# Altium schematic sheet 00_POWER.SchDoc
size A; SheetNumber: 1; SheetTotal: 5
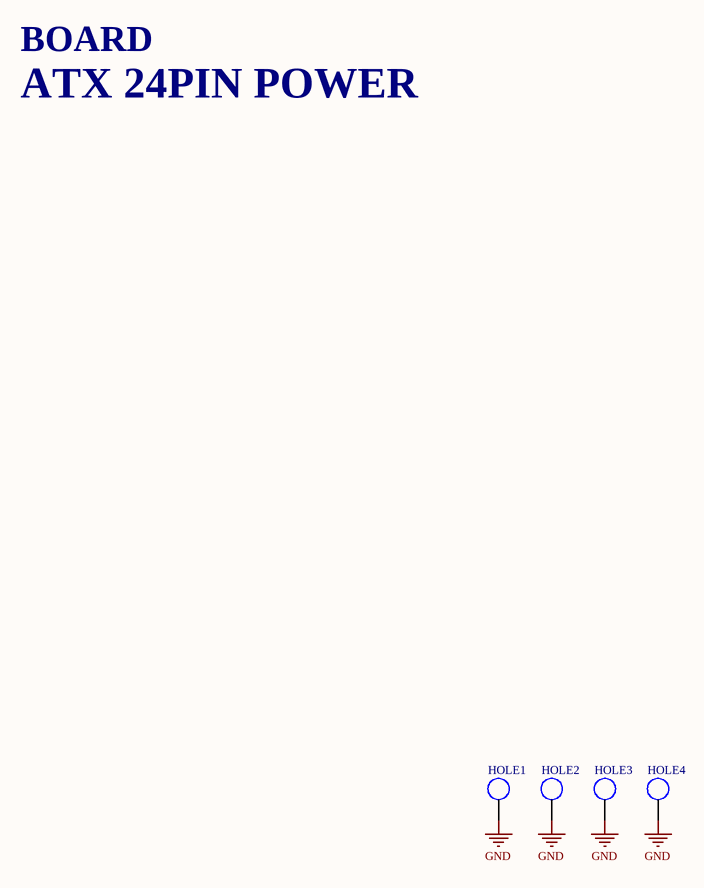
[diagram p0: 00_POWER.SchDoc]

## Parts
HOLE1  LOADHOLE  [LOADHOLE]  (value not drawn)
HOLE2  LOADHOLE  [LOADHOLE]  (value not drawn)
HOLE3  LOADHOLE  [LOADHOLE]  (value not drawn)
HOLE4  LOADHOLE  [LOADHOLE]  (value not drawn)

## Nets
GND: HOLE1.1 HOLE2.1 HOLE3.1 HOLE4.1

## Notes on the sheet
- BOARD
- ATX 24PIN POWER